# EAGLE design takahoot-bumper (EAGLE 9.5.0)
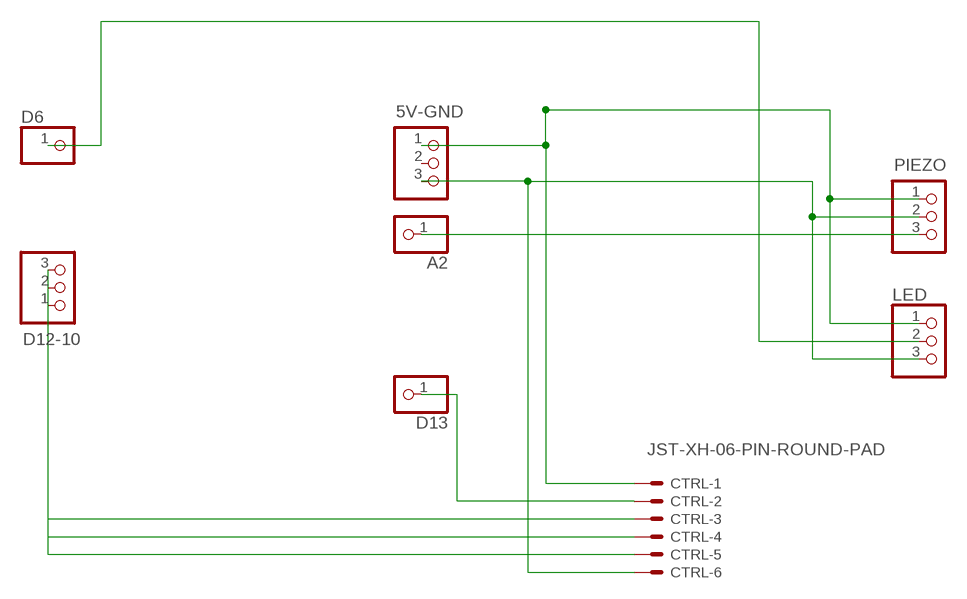
[diagram p0: schematic, sheet 1]

## Parts
5V-GND  PINHD-1X3  [1X03]
A2  PINHD-1X1  [1X01]
CTRL  JST-XH-06-PIN-ROUND-PAD  [JST-XH-06-PACKAGE-ROUND-PAD]
D6  PINHD-1X1  [1X01]
D12-10  PINHD-1X3  [1X03]
D13  PINHD-1X1  [1X01]
LED  PINHD-1X3/90  [1X03/90]
PIEZO  PINHD-1X3/90  [1X03/90]

## Nets
N$1: CTRL.5 D12-10.1
N$2: CTRL.4 D12-10.2
N$3: CTRL.3 D12-10.3
N$4: CTRL.2 D13.1
N$5: 5V-GND.3 CTRL.6 LED.3 PIEZO.2
N$6: 5V-GND.1 CTRL.1 LED.1 PIEZO.1
N$7: A2.1 PIEZO.3
N$8: D6.1 LED.2
Unconnected: 5V-GND.2

## Library data of the parts
5V-GND D12-10 LED PIEZO = pinhead:PINHD-1X3: PIN HEADER
A2 D6 D13 = pinhead:PINHD-1X1: PIN HEADER
CTRL = Rembrandt Electronics - JST XH Connectors v1-0:JST-XH-06-PIN: JST XH Connector 2 Pin Wire to board connector. Pitch: 2,54 mm, (0.100") Number of pins: 6 Created by Rembrandt Electronics www.rembrandtelectronics.com

## Board
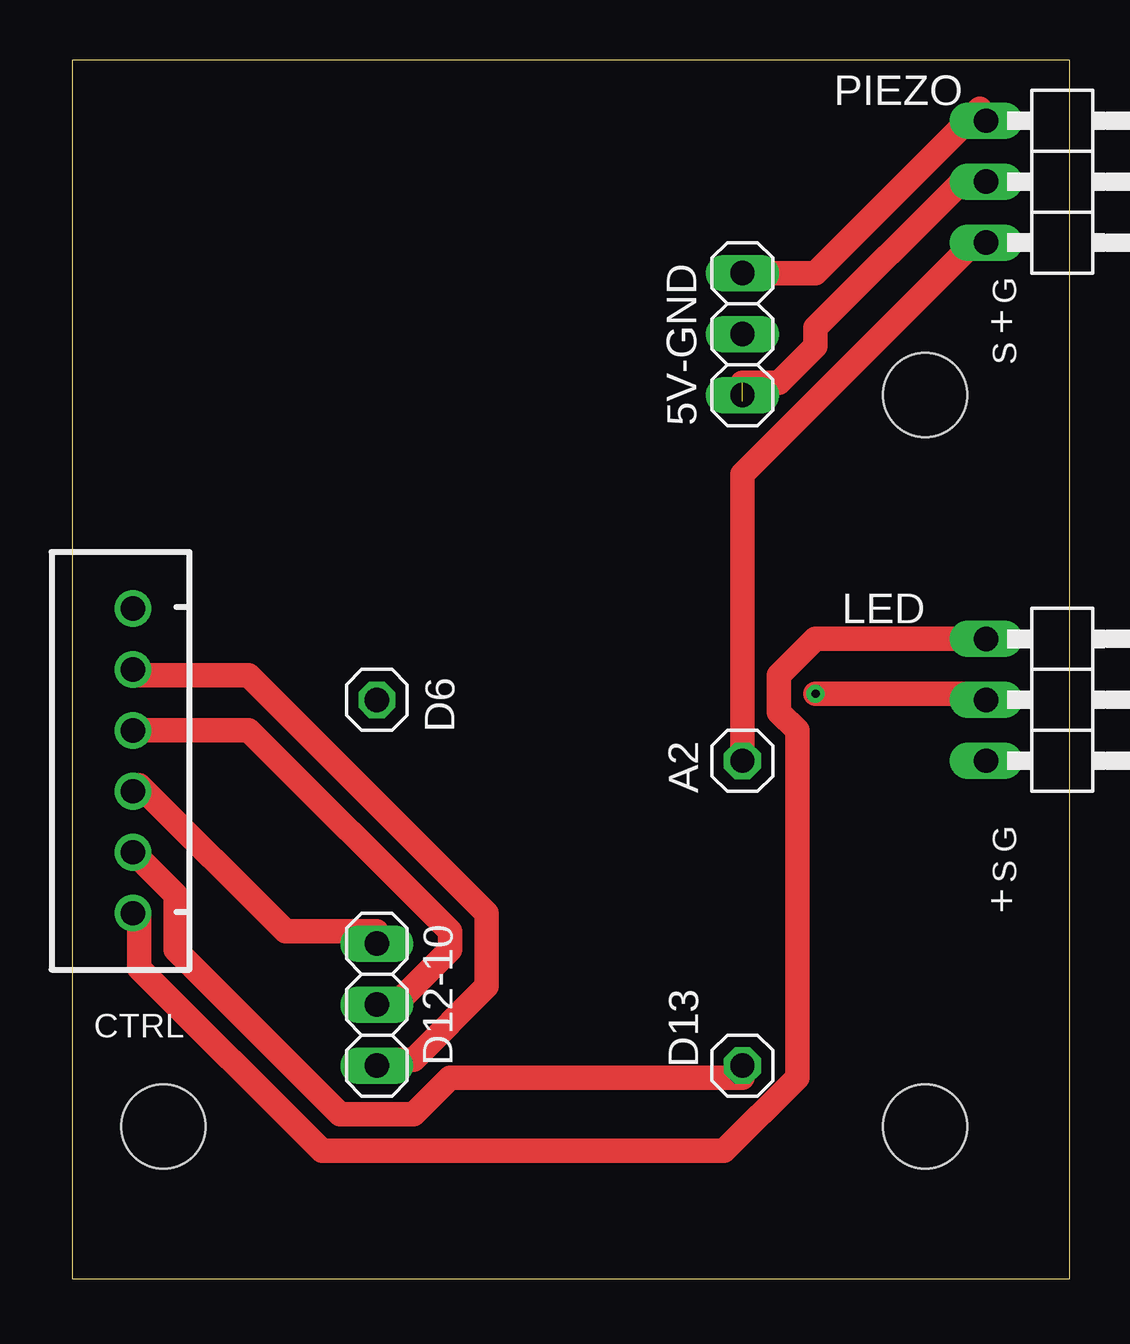
[diagram p1: board, top side]
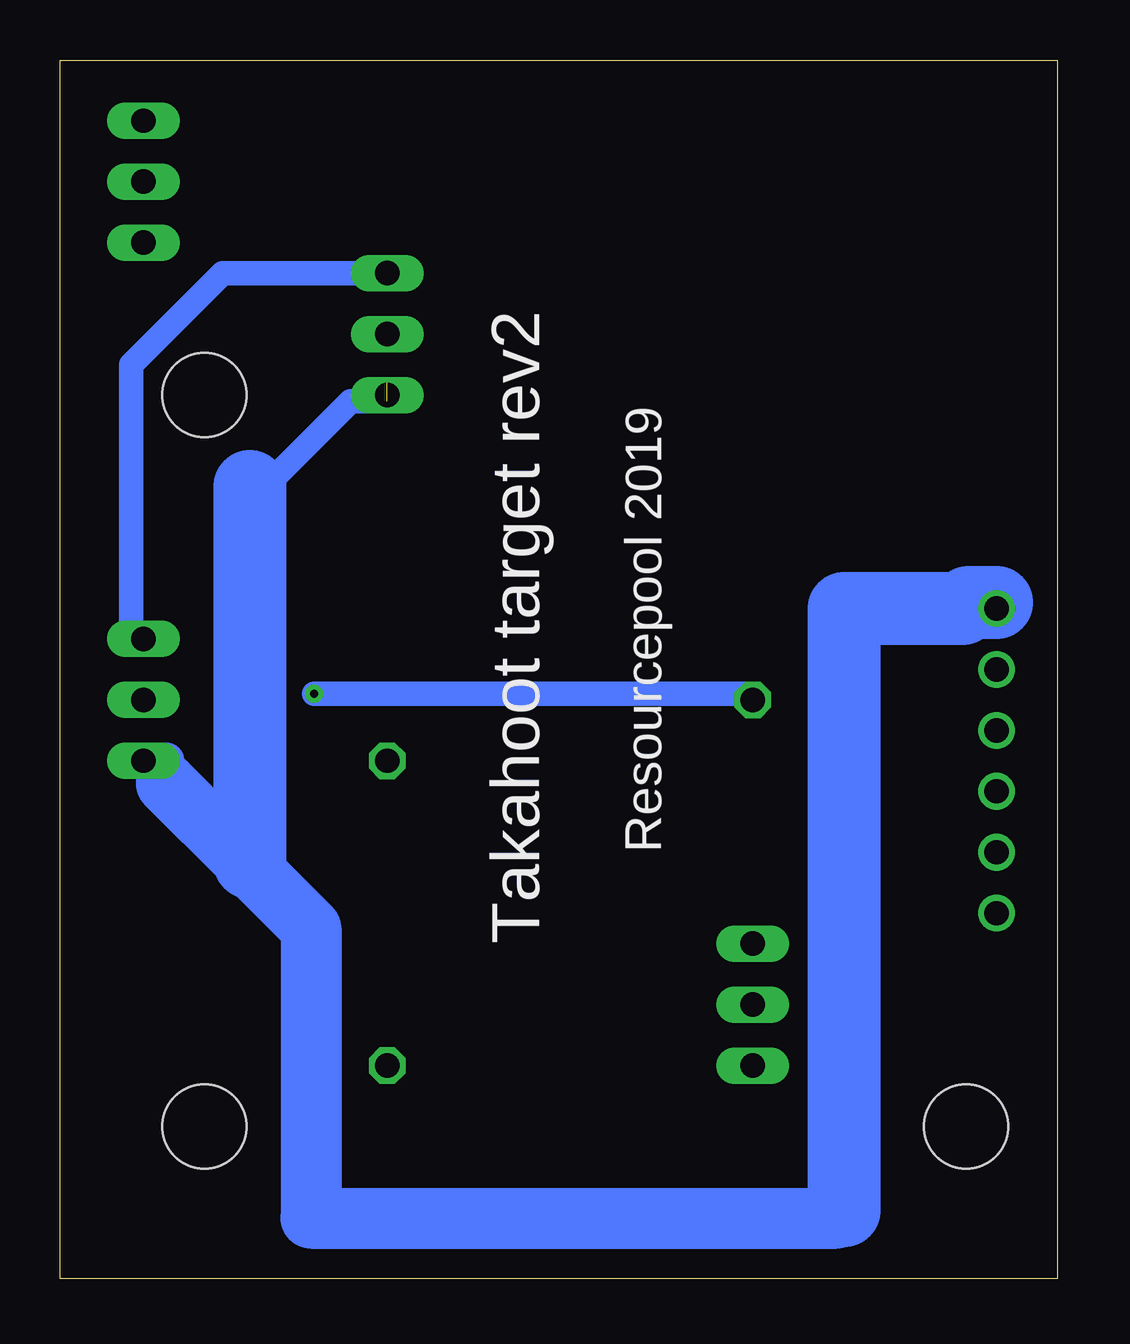
[diagram p2: board, bottom side, seen from below]

Size 41.58 x 50.79 mm. Coordinates in mm from the lower left corner, seen from the top.
Outline: 0,0 41.58,0 41.58,50.79 0,50.79 0,0
Copper layers (1*16): Top 0.035mm / dielectric 1.5mm / Bottom 0.035mm
Design rules "default *": minimum track width 40mil, minimum drill 0.35mm, track to track 20mil, track to pad 20mil, pad to pad 20mil, via to via 20mil, smd to smd 6mil, copper to edge 20mil, drill to drill 6mil, minimum pad ring 10mil, minimum via ring 8mil, stop-mask expansion 4mil, vias tented up to drill 0mil, thermal gap 10mil
Holes 3.51 mm at 35.56,6.35 35.56,36.83 3.81,6.35

### Footprints (pad centres in the part's own frame; a part is rotated, then mirrored left to right if it is on the bottom)
1X03 = drill 1.016 long: 1 -2.54,0; 2 0,0; 3 2.54,0
1X01 = drill 1.016 octagon: 1 0,0
JST-XH-06-PACKAGE-ROUND-PAD = drill 1.016: 1 -6.35,0; 2 -3.81,0; 3 -1.27,0; 4 1.27,0; 5 3.81,0; 6 6.35,0
1X03/90 = drill 1.016 long: 1 -2.54,-3.81; 2 0,-3.81; 3 2.54,-3.81

### Placement (x,y rotation side)
5V-GND  27.94,39.37 270 top
A2  27.94,21.59 0 top
CTRL  2.54,21.59 90 top
D6  12.7,24.13 0 top
D12-10  12.7,11.43 90 top
D13  27.94,8.89 0 top
LED  41.91,24.13 270 top
PIEZO  41.91,45.72 270 top

### Tracks (layer width: path | path; a pad name or v marks a point on that pad's centre or on a via)
N$1
  Top 1.016: CTRL.5 2.79,25.15 7.37,25.15 17.27,15.24 17.27,12.19 14.22,9.14 12.7,9.14 D12-10.1
N$2
  Top 1.016: CTRL.4 7.37,22.86 15.75,14.48 15.75,13.72 13.46,11.43 D12-10.2
N$3
  Top 1.016: D12-10.3 12.7,14.48 8.89,14.48 2.79,20.57 CTRL.3
N$4
  Top 1.016: CTRL.2 4.32,16 4.32,13.72 11.18,6.86 14.22,6.86 15.75,8.38 27.94,8.38 D13.1
N$5  (2 unrouted)
  Top 1.016: PIEZO.2 37.08,45.72 30.99,39.62 30.99,38.86 29.46,37.34 27.94,37.34
  Bottom 1.016: 9.21,2.54 8.89,2.86 | 33.66,17.36 33.97,17.46 | CTRL.6 2.79,28.19 3.95,27.94 | 27.94,36.58 29.46,36.58 32.51,33.53 33.66,33.02
  Bottom 1.524: LED.3 37.15,21.59 37.15,20.64
  Bottom 2.54: 9.21,2.54 31.11,2.54 31.11,14.61 33.97,17.46 37.15,20.64
  Bottom 3.048: 33.66,17.36 33.66,33.02 | 2.54,28.19 2.79,28.19 3.7,28.19 3.95,27.94 8.89,27.94 8.89,2.86
N$6
  Top 1.016: 5V-GND.1 30.99,41.91 37.85,48.77 PIEZO.1 | LED.1 30.99,26.67 29.46,25.15 29.46,23.62 30.23,22.86 30.23,8.38 27.18,5.33 10.41,5.33 2.79,12.95 2.79,15.24 CTRL.1
  Bottom 1.016: 5V-GND.1 34.8,41.91 38.61,38.1 38.61,26.67 LED.1
N$7
  Top 1.016: A2.1 27.94,33.53 37.85,43.43 PIEZO.3
N$8  (via drill 0.35)
  Top 1.016: v30.99,24.38 37.85,24.38 LED.2
  Bottom 1.016: v30.99,24.38 12.7,24.38 D6.1

### Text on the board
tNames: G | + | S | G | S | +
bNames: Resourcepool 2019 | Takahoot target rev2